# Altium schematic sheet RHS.SchDoc: RHS
size OrCAD A; ApprovedBy: Abbas Mahmoud; CheckedBy: Abbas Mahmoud; Author: Abbas Mahmoud; CompanyName: lsa 4wya :); DrawnBy: Abbas Mahmoud; Engineer: Abbas Mahmoud; DocumentNumber: 5; Revision: 1; SheetNumber: 5; SheetTotal: 8
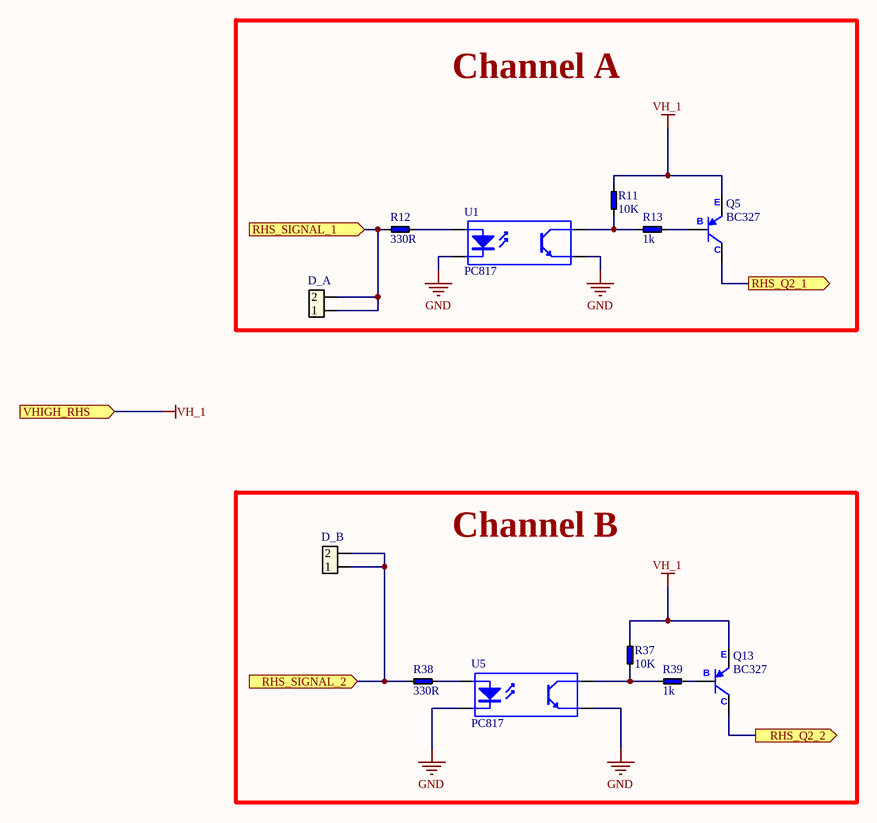
[diagram p0: RHS.SchDoc]

## Parts
D_A  Header 2  [PINHEADER X2]  (value not drawn)
D_B  Header 2  [PINHEADER X2]  (value not drawn)
Q5  BC327  [Transistor - duplicate3]
Q13  BC327  [Transistor - duplicate3]
R11  10K  [RESISTOR _9]
R12  330R  [RESISTOR _9]
R13  1k  [RESISTOR _9]
R37  10K  [RESISTOR _9]
R38  330R  [RESISTOR _9]
R39  1k  [RESISTOR _9]
U1  PC817  [IC X4 PIN]
U5  PC817  [IC X4 PIN]

## Blocks framed on the sheet
Channel A: D_A Q5 R11-R13 U1
Channel B: D_B Q13 R37-R39 U5

## Ports
RHS_Q2_1 (out), RHS_Q2_2 (out), RHS_SIGNAL_1 (in), RHS_SIGNAL_2 (in), VHIGH_RHS (in)

## Nets
GND: U1.2(K) U1.3(E) U5.2(K) U5.3(E)
VH_1: Q5.1(E) Q13.1(E) R11.2 R37.2 ; port VHIGH_RHS
RHS_Q2_1: Q5.3(C) ; port RHS_Q2_1
RHS_Q2_2: Q13.3(C) ; port RHS_Q2_2
RHS_SIGNAL_1: D_A.1 D_A.2 R12.1 ; port RHS_SIGNAL_1
RHS_SIGNAL_2: D_B.1 D_B.2 R38.1 ; port RHS_SIGNAL_2
NetQ5_2: Q5.2(B) R13.2
NetQ13_2: Q13.2(B) R39.2
NetR11_1: R11.1 R13.1 U1.4(C)
NetR12_2: R12.2 U1.1(A)
NetR37_1: R37.1 R39.1 U5.4(C)
NetR38_2: R38.2 U5.1(A)

## Notes on the sheet
- Title
- Size:
- Date:
- Orcad A
- Number:
- Time:
- Revision:
- Sheet
- of
- File:

## Library data of the parts
D_A D_B = Header 2: Header, 2-Pin; LatestRevisionDate: 17-Jul-2002; LatestRevisionNote: Re-released for DXP Platform.; Publisher: Altium Limited
Q5 Q13 = PNP
R11-R13 R37-R39 = RESISTOR
U1 U5 = Opto-coupler: 4-Pin Phototransistor Optocoupler; Published: 24-Mar-1999; LatestRevisionDate: 04-Mar-2005; LatestRevisionNote: Sch pins 3 & 4 Swapped.; DatasheetVersion: Nov-2003; PackageReference: DIP-4; Publisher: Altium Limited